# EAGLE design ET57 (EAGLE 9.2.0)
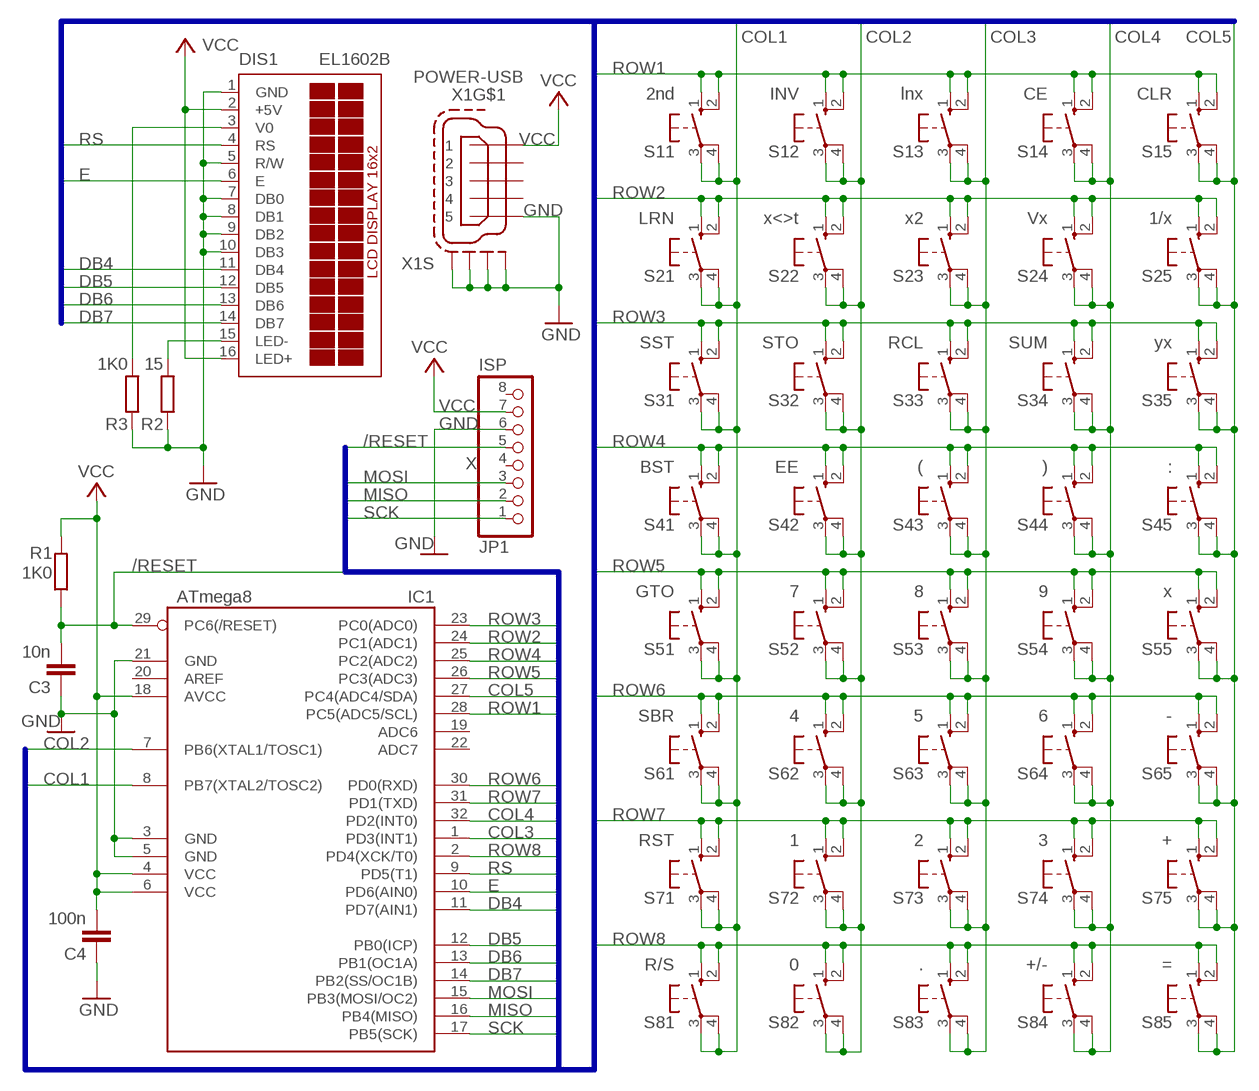
[diagram p0: schematic, sheet 1]

## Parts
C3  10n  C-EUC0805  [C0805]
C4  100n  C-EUC0805  [C0805]
DIS1  EL1602B  [EL1602B]
IC1  ATmega8  MEGA8-AI  [TQFP32-08]
JP1  ISP  PINHD-1X8BIG  [1X08-BIG]
R1  1K0  R-EU_R0805  [R0805]
R2  15  R-EU_R0805  [R0805]
R3  1K0  R-EU_R0805  [R0805]
S11  2nd  10-XX  [B3F-10XX]
S12  INV  10-XX  [B3F-10XX]
S13  lnx  10-XX  [B3F-10XX]
S14  CE  10-XX  [B3F-10XX]
S15  CLR  10-XX  [B3F-10XX]
S21  LRN  10-XX  [B3F-10XX]
S22  x<>t  10-XX  [B3F-10XX]
S23  x2  10-XX  [B3F-10XX]
S24  Vx  10-XX  [B3F-10XX]
S25  1/x  10-XX  [B3F-10XX]
S31  SST  10-XX  [B3F-10XX]
S32  STO  10-XX  [B3F-10XX]
S33  RCL  10-XX  [B3F-10XX]
S34  SUM  10-XX  [B3F-10XX]
S35  yx  10-XX  [B3F-10XX]
S41  BST  10-XX  [B3F-10XX]
S42  EE  10-XX  [B3F-10XX]
S43  (  10-XX  [B3F-10XX]
S44  )  10-XX  [B3F-10XX]
S45  :  10-XX  [B3F-10XX]
S51  GTO  10-XX  [B3F-10XX]
S52  7  10-XX  [B3F-10XX]
S53  8  10-XX  [B3F-10XX]
S54  9  10-XX  [B3F-10XX]
S55  x  10-XX  [B3F-10XX]
S61  SBR  10-XX  [B3F-10XX]
S62  4  10-XX  [B3F-10XX]
S63  5  10-XX  [B3F-10XX]
S64  6  10-XX  [B3F-10XX]
S65  -  10-XX  [B3F-10XX]
S71  RST  10-XX  [B3F-10XX]
S72  1  10-XX  [B3F-10XX]
S73  2  10-XX  [B3F-10XX]
S74  3  10-XX  [B3F-10XX]
S75  +  10-XX  [B3F-10XX]
S81  R/S  10-XX  [B3F-10XX]
S82  0  10-XX  [B3F-10XX]
S83  .  10-XX  [B3F-10XX]
S84  +/-  10-XX  [B3F-10XX]
S85  =  10-XX  [B3F-10XX]
X1  POWER-USB  MINI-USB-SCHIELD-32005-201  [32005-201]

## Nets
/RESET: C3.2 IC1.29(PC6(/RESET)) JP1.5 R1.1
COL1: IC1.8(PB7(XTAL2/TOSC2)) S11.3(P) S11.4(P1) S21.3(P) S21.4(P1) S31.3(P) S31.4(P1) S41.3(P) S41.4(P1) S51.3(P) S51.4(P1) S61.3(P) S61.4(P1) S71.3(P) S71.4(P1) S81.3(P) S81.4(P1)
COL2: IC1.7(PB6(XTAL1/TOSC1)) S12.3(P) S12.4(P1) S22.3(P) S22.4(P1) S32.3(P) S32.4(P1) S42.3(P) S42.4(P1) S52.3(P) S52.4(P1) S62.3(P) S62.4(P1) S72.3(P) S72.4(P1) S82.3(P) S82.4(P1)
COL3: IC1.1(PD3(INT1)) S13.3(P) S13.4(P1) S23.3(P) S23.4(P1) S33.3(P) S33.4(P1) S43.3(P) S43.4(P1) S53.3(P) S53.4(P1) S63.3(P) S63.4(P1) S73.3(P) S73.4(P1) S83.3(P) S83.4(P1)
COL4: IC1.32(PD2(INT0)) S14.3(P) S14.4(P1) S24.3(P) S24.4(P1) S34.3(P) S34.4(P1) S44.3(P) S44.4(P1) S54.3(P) S54.4(P1) S64.3(P) S64.4(P1) S74.3(P) S74.4(P1) S84.3(P) S84.4(P1)
COL5: IC1.27(PC4(ADC4/SDA)) S15.3(P) S15.4(P1) S25.3(P) S25.4(P1) S35.3(P) S35.4(P1) S45.3(P) S45.4(P1) S55.3(P) S55.4(P1) S65.3(P) S65.4(P1) S75.3(P) S75.4(P1) S85.3(P) S85.4(P1)
DB4: DIS1.11(DB4) IC1.11(PD7(AIN1))
DB5: DIS1.12(DB5) IC1.12(PB0(ICP))
DB6: DIS1.13(DB6) IC1.13(PB1(OC1A))
DB7: DIS1.14(DB7) IC1.14(PB2(SS/OC1B))
E: DIS1.6(E) IC1.10(PD6(AIN0))
GND: C3.1 C4.1 DIS1.1(GND) DIS1.5(R/W) DIS1.7(DB0) DIS1.8(DB1) DIS1.9(DB2) DIS1.10(DB3) IC1.3(GND) IC1.5(GND) IC1.21(GND) JP1.6 R2.1 R3.1 X1.5 X1.M1(S:S1) X1.M2(S:S2) X1.M3(S:S3) X1.M4(S:S4)
MISO: IC1.16(PB4(MISO)) JP1.2
MOSI: IC1.15(PB3(MOSI/OC2)) JP1.3
N$1: DIS1.15(LED-) R2.2
N$2: DIS1.3(V0) R3.2
ROW1: IC1.28(PC5(ADC5/SCL)) S11.1(S) S11.2(S1) S12.1(S) S12.2(S1) S13.1(S) S13.2(S1) S14.1(S) S14.2(S1) S15.1(S) S15.2(S1)
ROW2: IC1.24(PC1(ADC1)) S21.1(S) S21.2(S1) S22.1(S) S22.2(S1) S23.1(S) S23.2(S1) S24.1(S) S24.2(S1) S25.1(S) S25.2(S1)
ROW3: IC1.23(PC0(ADC0)) S31.1(S) S31.2(S1) S32.1(S) S32.2(S1) S33.1(S) S33.2(S1) S34.1(S) S34.2(S1) S35.1(S) S35.2(S1)
ROW4: IC1.25(PC2(ADC2)) S41.1(S) S41.2(S1) S42.1(S) S42.2(S1) S43.1(S) S43.2(S1) S44.1(S) S44.2(S1) S45.1(S) S45.2(S1)
ROW5: IC1.26(PC3(ADC3)) S51.1(S) S51.2(S1) S52.1(S) S52.2(S1) S53.1(S) S53.2(S1) S54.1(S) S54.2(S1) S55.1(S) S55.2(S1)
ROW6: IC1.30(PD0(RXD)) S61.1(S) S61.2(S1) S62.1(S) S62.2(S1) S63.1(S) S63.2(S1) S64.1(S) S64.2(S1) S65.1(S) S65.2(S1)
ROW7: IC1.31(PD1(TXD)) S71.1(S) S71.2(S1) S72.1(S) S72.2(S1) S73.1(S) S73.2(S1) S74.1(S) S74.2(S1) S75.1(S) S75.2(S1)
ROW8: IC1.2(PD4(XCK/T0)) S81.1(S) S81.2(S1) S82.1(S) S82.2(S1) S83.1(S) S83.2(S1) S84.1(S) S84.2(S1) S85.1(S) S85.2(S1)
RS: DIS1.4(RS) IC1.9(PD5(T1))
SCK: IC1.17(PB5(SCK)) JP1.1
VCC: C4.2 DIS1.2(+5V) DIS1.16(LED+) IC1.4(VCC) IC1.6(VCC) IC1.18(AVCC) JP1.7 R1.2 X1.1
Unconnected: IC1.19(ADC6) IC1.20(AREF) IC1.22(ADC7) JP1.4 JP1.8 X1.2 X1.3 X1.4

## Buses
COL1,COL2,COL3,COL4,COL5,DB4,DB5,DB6,DB7,E,GND,MISO,MOSI,/RESET,ROW1,ROW2,ROW3,ROW4,ROW5,ROW6,ROW7,ROW8,RS,SCK,VCC

## Notes on the sheet
- X

## Library data of the parts
C3 C4 = rcl:C-EU: CAPACITOR, European symbol; SPICEPREFIX: C
DIS1 = LCD display EL1602B:EL1602B: EL1602B, LCD display 16x2 characters without background light; OC_FARNELL: unknown; OC_NEWARK: unknown
IC1 = atmel:MEGA8: MICROCONTROLLER 8 Kbytes FLASH, 1 kbytes SRAM, 512 bytes EEPROM, USART, 6-channel 10 bit ADC, 2-channel 8 bit ADC Pin compatible with Atmega48, ATMega88, ATMega168 Source: avr.lbr; MPN: ATMEGA8-16AU; OC_FARNELL: 9171371; OC_NEWARK: 73M8863
JP1 = adafruit:PINHD-1X8: PIN HEADER
R1-R3 = rcl:R-EU_: RESISTOR, European symbol; SPICEPREFIX: R
S11-S15 S21-S25 S31-S35 S41-S45 S51-S55 S61-S65 S71-S75 S81-S85 = switch-omron2:10-XX: OMRON SWITCH; MPN: B3F-1000; OC_FARNELL: 176432; OC_NEWARK: 36M3542
X1 = con-cypressindustries:MINI-USB-SCHIELD-: MINI USB-B Conector Source: www.cypressindustries.com; OC_FARNELL: unknown; OC_NEWARK: unknown

## Board
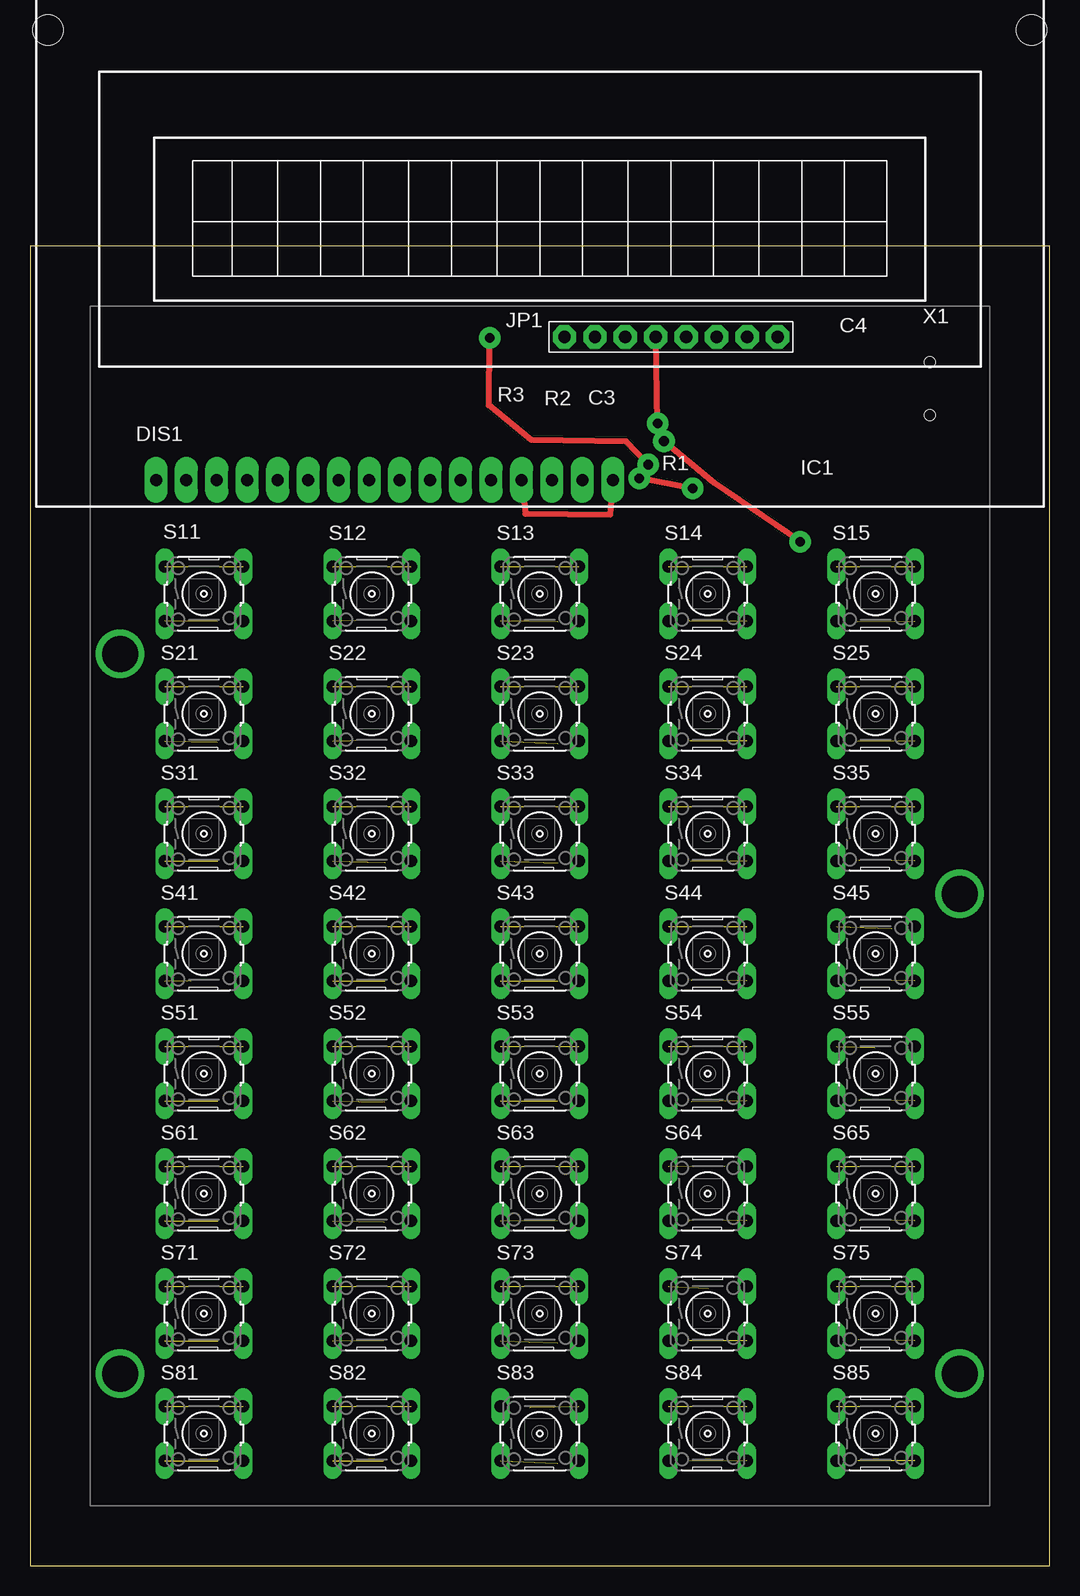
[diagram p1: board, top side]
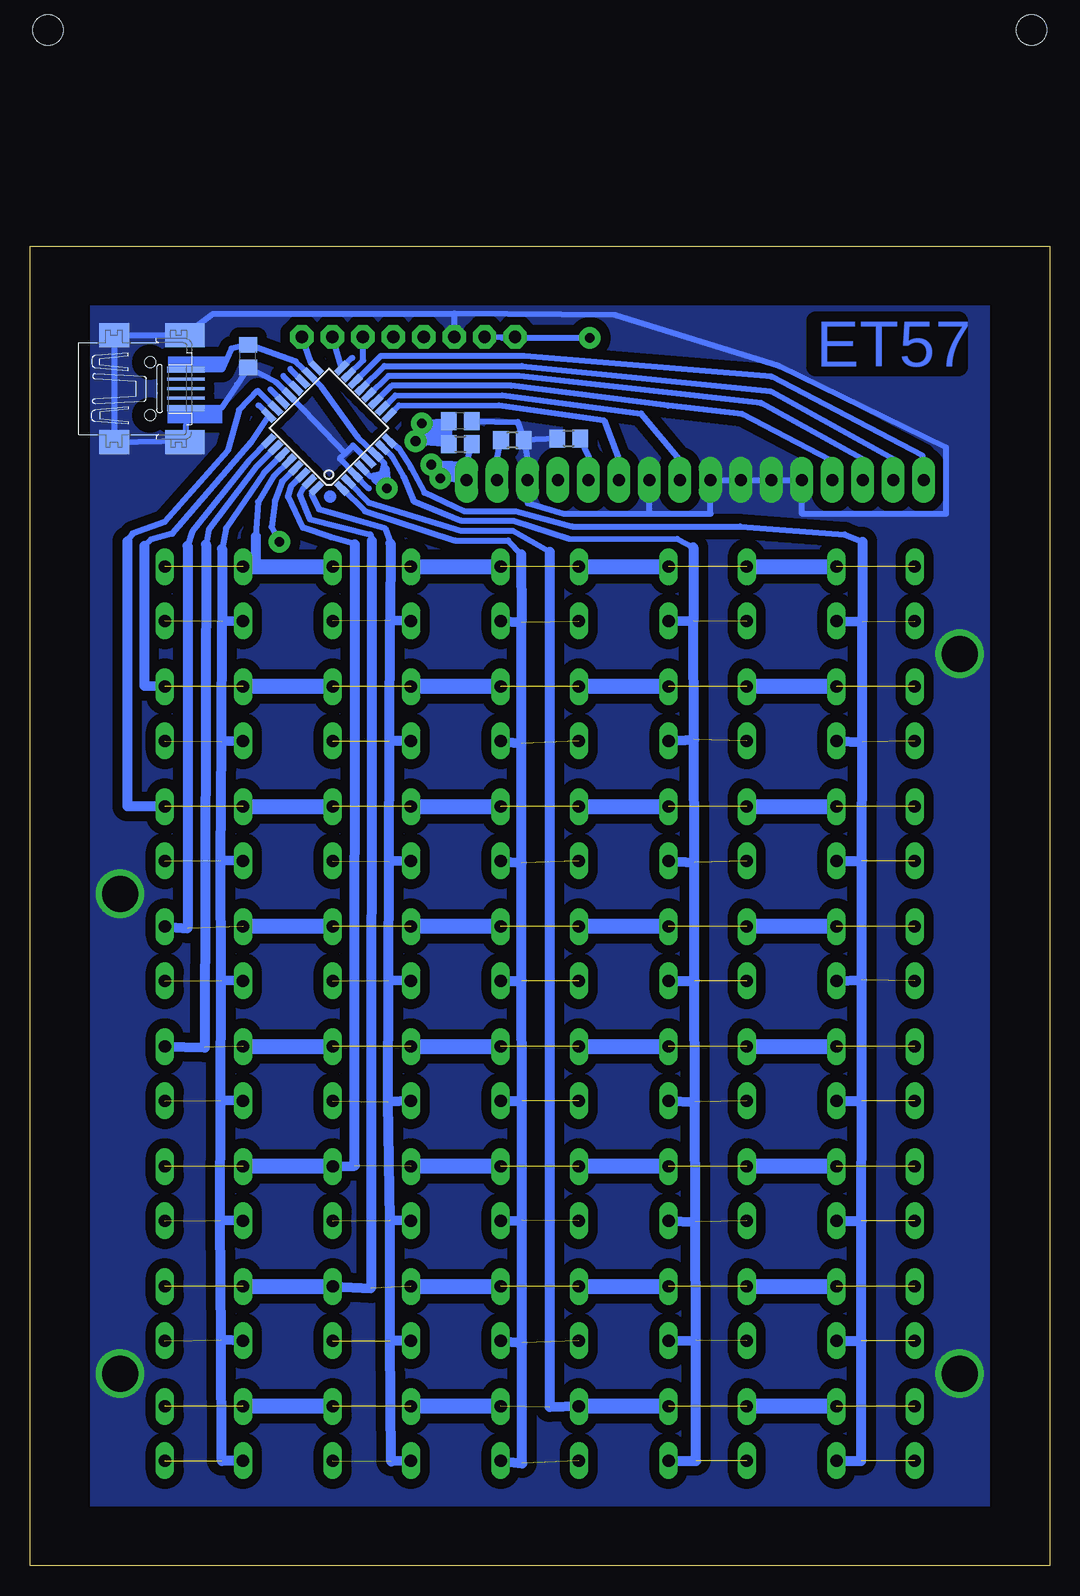
[diagram p2: board, bottom side, seen from below]

Size 85 x 110 mm. Coordinates in mm from the lower left corner, seen from the top.
Outline: 0,0 85,0 85,110 0,110 0,0
Copper layers (1*16): Top 0.035mm / dielectric 1.5mm / Bottom 0.035mm
Design rules "default": minimum track width 6mil, minimum drill 0.35mm, track to track 6mil, track to pad 6mil, pad to pad 6mil, via to via 6mil, smd to smd 6mil, copper to edge 40mil, drill to drill 6mil, minimum pad ring 10mil, minimum via ring 8mil, stop-mask expansion 4mil, vias tented up to drill 0mil, thermal gap 10mil

### Footprints (pad centres in the part's own frame; a part is rotated, then mirrored left to right if it is on the bottom)
C0805 = smd 1.3 x 1.5: 1 -0.95,0; 2 0.95,0
EL1602B = drill 1 pad 1.93 long: 1 1.02,-19.5; 2 -1.52,-19.5; 3 -4.06,-19.5; 4 -6.6,-19.5; 5 -9.14,-19.5; 6 -11.68,-19.5; 7 -14.22,-19.5; 8 -16.76,-19.5; 9 -19.3,-19.5; 10 -21.84,-19.5; 11 -24.38,-19.5; 12 -26.92,-19.5; 13 -29.46,-19.5; 14 -32,-19.5; 15 3.56,-19.5; 16 6.1,-19.5 | hole 2.5: -41,18; 41,18
TQFP32-08 = smd 1.27 x 0.559: 1 -4.293,2.8; 2 -4.293,2; 3 -4.293,1.2; 4 -4.293,0.4; 5 -4.293,-0.4; 6 -4.293,-1.2; 7 -4.293,-2; 8 -4.293,-2.8; 17 4.293,-2.8; 18 4.293,-2; 19 4.293,-1.2; 20 4.293,-0.4; 21 4.293,0.4; 22 4.293,1.2; 23 4.293,2; 24 4.293,2.8 | smd 0.559 x 1.27: 9 -2.8,-4.293; 10 -2,-4.293; 11 -1.2,-4.293; 12 -0.4,-4.293; 13 0.4,-4.293; 14 1.2,-4.293; 15 2,-4.293; 16 2.8,-4.293; 25 2.8,4.293; 26 2,4.293; 27 1.2,4.293; 28 0.4,4.293; 29 -0.4,4.293; 30 -1.2,4.293; 31 -2,4.293; 32 -2.8,4.293
1X08-BIG = drill 1.016 pad 1.93 octagon: 1 -8.89,0; 2 -6.35,0; 3 -3.81,0; 4 -1.27,0; 5 1.27,0; 6 3.81,0; 7 6.35,0; 8 8.89,0
R0805 = smd 1.3 x 1.5: 1 -0.95,0; 2 0.95,0
B3F-10XX = drill 1.016 long: 1 -3.251,2.261; 2 3.251,2.261; 3 -3.251,-2.261; 4 3.251,-2.261
32005-201 = smd 3.1 x 0.5: 1 3,1.6; 5 3,-1.6 | smd 3.1 x 0.254: 2 3,0.8; 3 3,0; 4 3,-0.8 | smd 2.5 x 2: M1 -3,-4.45; M2 -3,4.45 | smd 3.3 x 2: M3 2.9,4.45; M4 2.9,-4.45 | hole 0.9: 0,2.2; 0,-2.2

### Placement (x,y rotation side)
C3  49.12,95.4 180 bottom
C4  66.83,100.81 90 bottom
DIS1  42.5,110 0 top
IC1  60.07,94.82 135 bottom
JP1  53.44,102.41 180 top
R1  49.12,93.47 0 bottom
R2  44.78,93.8 180 bottom
R3  40.08,93.95 0 bottom
S11  14.5,81 0 top
S12  28.5,81 0 top
S13  42.5,81 0 top
S14  56.5,81 0 top
S15  70.5,81 0 top
S21  14.5,71 0 top
S22  28.5,71 0 top
S23  42.5,71 0 top
S24  56.5,71 0 top
S25  70.5,71 0 top
S31  14.5,61 0 top
S32  28.5,61 0 top
S33  42.5,61 0 top
S34  56.5,61 0 top
S35  70.5,61 0 top
S41  14.5,51 0 top
S42  28.5,51 0 top
S43  42.5,51 0 top
S44  56.5,51 0 top
S45  70.5,51 0 top
S51  14.5,41 0 top
S52  28.5,41 0 top
S53  42.5,41 0 top
S54  56.5,41 0 top
S55  70.5,41 0 top
S61  14.5,31 0 top
S62  28.5,31 0 top
S63  42.5,31 0 top
S64  56.5,31 0 top
S65  70.5,31 0 top
S71  14.5,21 0 top
S72  28.5,21 0 top
S73  42.5,21 0 top
S74  56.5,21 0 top
S75  70.5,21 0 top
S81  14.5,11 0 top
S82  28.5,11 0 top
S83  42.5,11 0 top
S84  56.5,11 0 top
S85  70.5,11 0 top
X1  75,98.1 0 bottom

### Tracks (layer width: path | path; a pad name or v marks a point on that pad's centre or on a via)
/RESET  (via drill 0.8 pad 1.8)
  Top 0.508: v64.21,85.34 57.05,90.25 v52.86,93.73 | v52.32,95.22 JP1.5
  Bottom 0.508: IC1.29 63.98,90.37 64.57,88.8 64.87,86.56 v64.21,85.34 | C3.2 R1.1 52.18,93.66 v52.86,93.73 v52.32,95.22 C3.2
  Bottom 0.813: v52.32,95.22 52.21,94.04 | 52.21,94.04 52.18,93.66 | v52.86,93.73 51.51,94.77 50.67,94.79 50.6,94.64 50.67,94.34 50.93,94.13 52.21,94.04
COL1  (8 unrouted)
  Bottom 0.508: IC1.8 54.28,93.14 53.24,91.52 52.12,89.43 48.84,87.91 44.5,87.88 39.78,86.61 25.78,86.61 17.07,85.95 15.6,85.34
  Bottom 0.813: S81.4 15.7,8.71 15.68,18.75 | 15.68,18.75 15.67,28.73 | 15.67,28.73 15.66,38.73 | 15.66,38.73 15.64,48.79 | 15.64,48.79 15.63,58.75 | 15.63,58.75 15.62,68.63 | 15.62,68.63 15.6,78.69 | 15.6,85.34 15.6,78.69 | S11.4 15.6,78.69 | S21.4 15.62,68.63 | S31.4 15.63,58.75 | S41.4 15.64,48.79 | S51.4 15.66,38.73 | S61.4 15.67,28.73 | S71.4 15.68,18.75
COL2  (8 unrouted)
  Bottom 0.508: 55.45,93.07 IC1.7 54.81,92.46 53.87,90.75 53.03,88.75 49.07,87.12 44.7,87.1 40.06,85.6 31.04,85.57 29.69,84.86
  Bottom 0.813: S82.4 29.46,8.71 29.49,18.77 | 29.49,18.77 29.52,28.65 | 29.52,28.65 29.55,38.66 | 29.55,38.66 29.58,48.74 | 29.58,48.74 29.61,58.62 | 29.61,58.62 29.64,68.83 | 29.64,68.83 29.67,78.79 | 29.69,84.86 29.67,78.79 | S12.4 29.67,78.79 | S22.4 29.64,68.83 | S32.4 29.61,58.62 | S42.4 29.58,48.74 | S52.4 29.55,38.66 | S62.4 29.52,28.65 | S72.4 29.49,18.77
COL3  (8 unrouted)
  Bottom 0.508: 59.16,89.89 IC1.1 57.07,87.88 49.55,85.45 45.14,85.45 44.04,84.3
  Bottom 0.813: S83.4 43.97,8.51 43.98,18.54 | 43.98,18.54 43.99,28.75 | 43.99,28.75 44,38.71 | 44,38.71 44.01,48.74 | 44.01,48.74 44.02,58.57 | 44.02,58.57 44.03,68.5 | 44.03,68.5 44.04,78.64 | 44.04,84.3 44.04,78.64 | S13.4 44.04,78.64 | S23.4 44.03,68.5 | S33.4 44.02,58.57 | S43.4 44.01,48.74 | S53.4 44,38.71 | S63.4 43.99,28.75 | S73.4 43.98,18.54
COL4  (9 unrouted)
  Bottom 0.508: IC1.32 61.52,89.36 60.91,88.06 55.4,86.46 54.94,85.22
  Bottom 0.813: 54.95,28.74 54.97,28.73 | S84.3 54.89,8.69 54.98,18.75 | 54.98,18.75 54.99,28.78 | 54.99,28.78 55.16,38.66 | 55.16,38.66 55.09,48.77 | 55.09,48.77 55.08,58.7 | 55.08,58.7 55.02,68.73 | 55.02,68.73 54.98,78.77 | 54.94,85.22 54.98,78.77 | S14.3 54.98,78.77 | S24.3 55.02,68.73 | S34.3 55.08,58.7 | S44.3 55.09,48.77 | S54.3 55.16,38.66 | S64.3 54.99,28.78 | S74.3 54.98,18.75
COL5  (8 unrouted)
  Bottom 0.508: IC1.27 65.48,91.08 68.66,86.46 68.99,84.76
  Bottom 0.813: S85.3 69.01,8.71 69.05,18.8 | 69.05,18.8 69.14,28.78 | 69.14,28.78 69.11,38.79 | 69.11,38.79 69.05,48.77 | 69.05,48.77 69.08,58.77 | 69.08,58.77 69.02,68.71 | 69.02,68.71 68.96,78.69 | 68.99,84.76 68.96,78.69 | S15.3 68.96,78.69 | S25.3 69.02,68.71 | S35.3 69.08,58.77 | S45.3 69.05,48.77 | S55.3 69.11,38.79 | S65.3 69.14,28.78 | S75.3 69.05,18.8
DB4
  Bottom 0.508: DIS1.11 18.26,92.15 25.6,95.96 31.77,96.67 44.88,98.35 54.84,98.35 IC1.11
DB5
  Bottom 0.508: DIS1.12 15.65,92.25 24.03,96.88 44.2,99.16 55.14,99.16 IC1.12
DB6
  Bottom 0.508: IC1.13 55.45,100 44.02,100 23.24,97.89 12.98,92.23 DIS1.13
DB7
  Bottom 0.508: DIS1.14 10.57,92.51 23.16,99.08 43.79,100.81 55.75,100.81 IC1.14
E
  Bottom 0.508: IC1.10 54.53,97.54 45.62,97.56 34.06,96.04 30.86,92.18 DIS1.6
GND  (via drill 3 pad 1.8)
  Bottom 0.508: 72.01,93.77 X1.M1 X1.M2 X1.M3 69.75,104.34 49.63,104.37 | 72.01,93.77 X1.M4 | IC1.5 58.06,93.37 58.73,92.69 | 58.73,92.69 62.13,96.29 IC1.21 64.49,98.63 C4.1 67.74,98.45 69.04,96.52 70.18,96.5 X1.5 72.01,93.77 | 58.73,92.69 59.18,92.25 IC1.3 56.77,89.79 | 49.63,104.37 JP1.6 | R2.1 43.56,92.38 DIS1.1 43.48,88.54 40.5,87.68 33.38,87.68 | R3.1 R2.1 | 33.38,87.68 33.36,87.68 DIS1.5 | 33.38,87.68 28.27,87.68 DIS1.7 DIS1.8 DIS1.9 DIS1.10 20.68,87.71 8.61,87.68 8.61,93.19 22.5,99.97 36.22,104.24 49.63,104.37 | C3.1 44.35,95.33 R2.1
  other vias: 7.5,16 77.5,16 7.5,76 77.5,56
  pour Bottom (isolate 0.813, no thermals): 5,5 5,105 80,105 80,5
MISO
  Bottom 0.508: JP1.2 59.41,101.09 IC1.16 58.14,100.69
MOSI
  Bottom 0.508: IC1.15 57.23,100.46 JP1.3
N$1
  Bottom 0.508: DIS1.15 46.08,92.25 R2.2
N$2
  Bottom 0.508: DIS1.3 38.41,92.35 R3.2
N$3
  Bottom 0.508: 62.36,98.78 63.3,99.75
N$4
  Bottom 0.508: 62.94,98.2 63.88,99.16
N$5
  Bottom 0.508: 64.03,97.1 64.97,98.04
ROW1  (5 unrouted)
  Bottom 0.508: IC1.28 64.67,90.81 65.99,88.65 66.17,85.8
  Bottom 0.813: 35.76,83.26 35.66,83.36 | 66.17,85.8 66.17,83.26
  Bottom 1.27: S15.1 66.17,83.26 S14.2 | S14.1 S13.2 | S13.1 35.76,83.26 S12.2 | S12.1 S11.2
ROW2  (5 unrouted)
  Bottom 0.508: 75.46,85.01 74.93,85.52 73.13,86 66.6,93.6 IC1.24 65.94,96.72
  Bottom 0.813: S25.2 75.46,73.33 75.46,85.01
  Bottom 1.27: S21.2 S22.1 | S22.2 S23.1 | S23.2 S24.1 | S24.2 S25.1
ROW3  (5 unrouted)
  Bottom 0.508: IC1.23 66.02,97.92 67.56,96.32 68.53,92.91 73.76,87 76.45,86.03 76.89,85.39
  Bottom 0.813: S35.2 76.89,63.27 76.89,85.39
  Bottom 1.27: S35.1 S34.2 | S34.1 S33.2 | S33.1 S32.2 | S32.1 S31.2
ROW4  (5 unrouted)
  Bottom 0.508: IC1.25 66.75,92.08 71.48,86.18 71.86,85.01
  Bottom 0.813: S45.2 71.86,53.11 71.86,85.01
  Bottom 1.27: S41.2 S42.1 | S42.2 S43.1 | S43.2 S44.1 | S44.2 S45.1
ROW5  (5 unrouted)
  Bottom 0.508: IC1.26 66.14,91.57 70.1,86.36 70.33,85.11
  Bottom 0.813: S55.2 70.43,43.18 70.33,85.11
  Bottom 1.27: S55.1 S54.2 | S54.1 S53.2 | S53.1 S52.2 | S52.1 S51.2
ROW6  (5 unrouted)
  Bottom 0.508: 57.91,85.14 59.92,85.72 62.26,86.51 63.5,89.1 63.2,90.02 IC1.30
  Bottom 0.813: S64.2 57.94,33.33 57.91,85.14
  Bottom 1.27: S61.2 S62.1 | S62.2 S63.1 | S63.2 S64.1 | S64.2 S65.1
ROW7  (5 unrouted)
  Bottom 0.508: IC1.31 62.26,89.74 62.51,89.26 61.67,87.22 56.62,85.95 56.52,85.42
  Bottom 0.813: S74.2 56.57,23.11 56.52,85.42
  Bottom 1.27: S75.1 S74.2 | S74.1 S73.2 | S73.1 S72.2 | S72.1 S71.2
ROW8  (5 unrouted)
  Bottom 0.508: IC1.2 56.74,88.59 49.1,86.26 44.76,86.26 41.68,84.51
  Bottom 0.813: S83.1 41.68,13.21 41.68,84.51
  Bottom 1.27: S81.2 S82.1 | S82.2 S83.1 | S83.2 S84.1 | S84.2 S85.1
RS
  Bottom 0.508: IC1.9 54.25,96.7 45.9,96.72 37.16,95.48 35.99,92.41 DIS1.4
SCK
  Bottom 0.508: IC1.17 61.57,100.25 JP1.1
VCC  (via drill 0.8 pad 1.8)
  Top 0.508: v55.24,89.79 v50.8,90.63 | v51.54,91.77 49.71,93.7 41.81,93.83 38.25,96.72 v38.33,102.34 | DIS1.2 41.3,87.68 48.39,87.61 DIS1.16
  Bottom 0.508: IC1.4 56.62,90.78 56.32,90.86 55.65,91.06 | 55.65,91.06 55.45,91.87 IC1.6 57.68,94.08 60.71,98.25 IC1.18 62.84,100.36 C4.2 68.2,101.45 68.99,99.69 X1.1 | 48.62,91.78 48.61,90.94 DIS1.16 v50.8,90.63 | 48.62,91.78 R1.2 | 55.65,91.06 v55.24,89.79 | v50.8,90.63 49.91,91.1 48.9,91.63 48.62,91.78 | v50.8,90.63 v51.54,91.77 | 44.53,102.36 45.71,102.37 | 45.71,102.37 v38.33,102.34 | 45.71,102.37 JP1.7
  Bottom 0.813: v50.8,90.63 48.61,90.94 | 48.9,91.63 v51.54,91.77 49.91,91.1 | 56.21,90.7 v55.24,89.79 55.4,91.36
(copper drawn outside any net)
  shapes: Bottom area x2, Bottom circle x1

### Text on the board
Bottom: ET57